# EAGLE design ATmega32_ComServ (EAGLE 6.1)
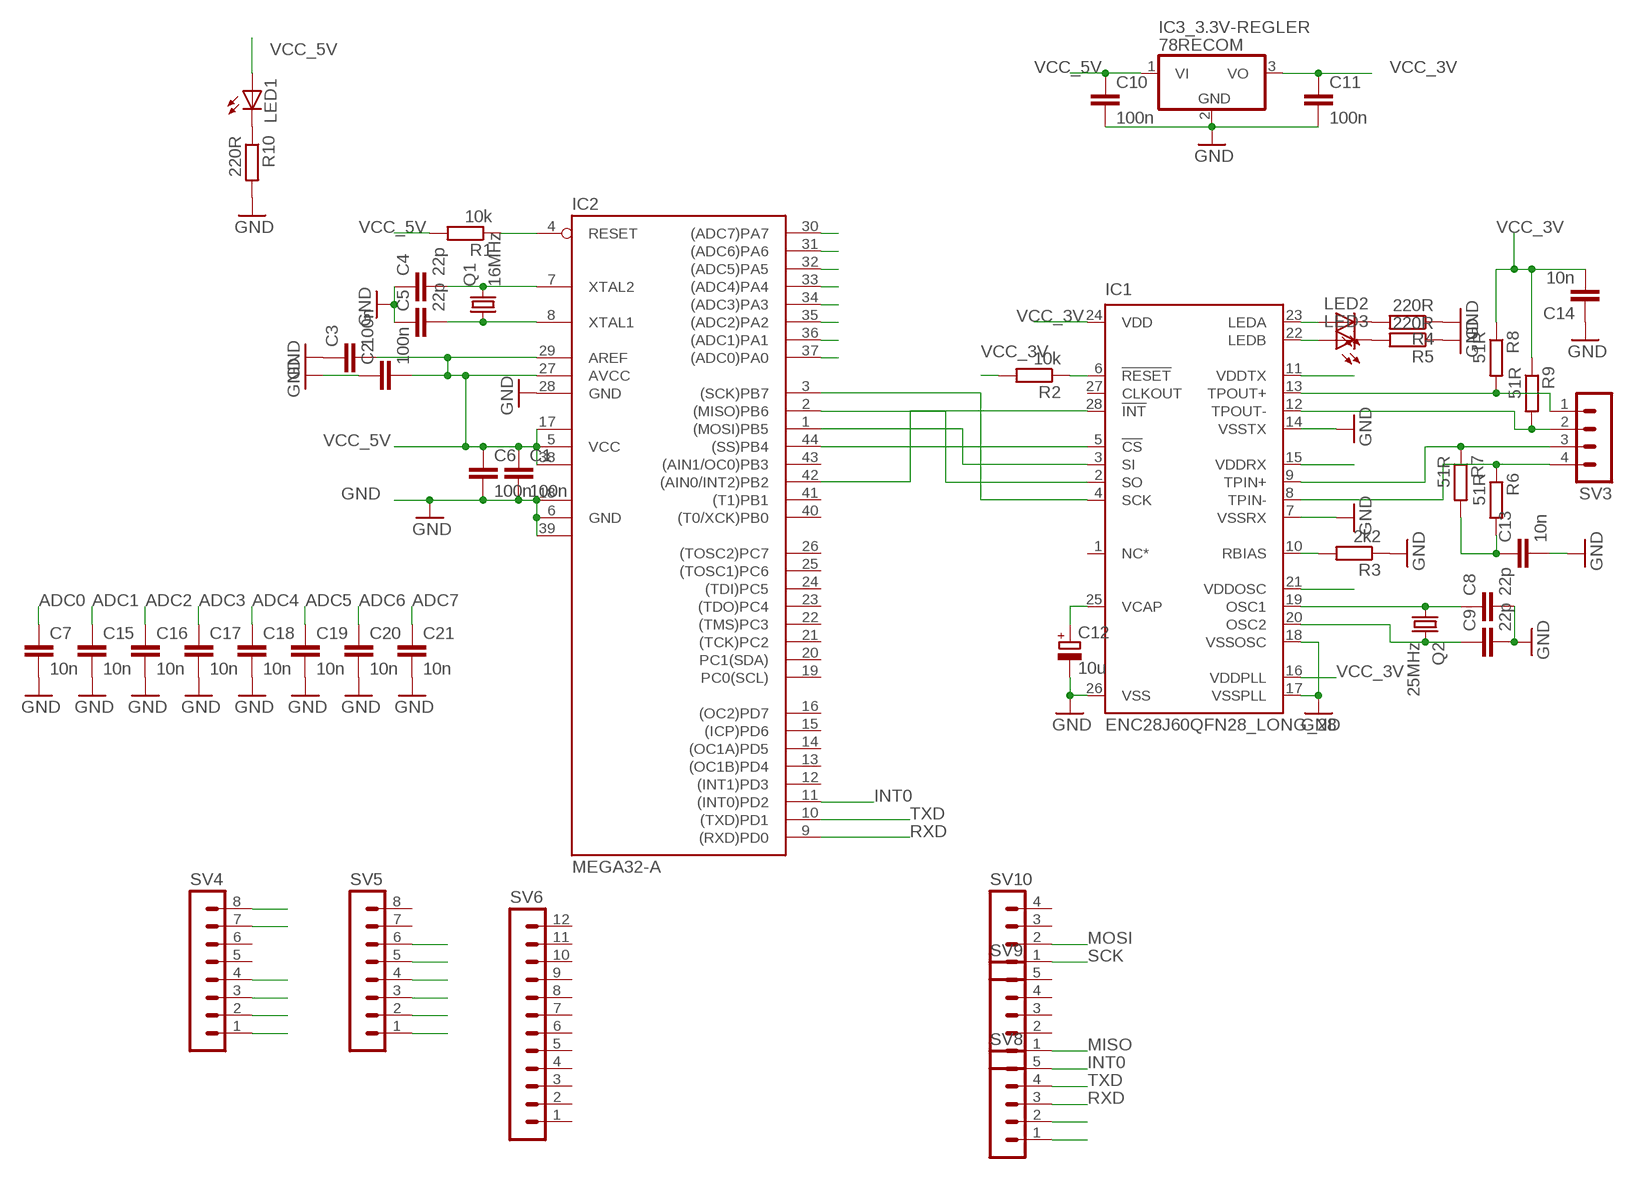
[diagram p0: schematic, sheet 1]

## Parts
C1  100n  C-EUC0805  [C0805]
C2  100n  C-EUC0805  [C0805]
C3  100n  C-EUC0805  [C0805]
C4  22p  C-EUC0805  [C0805]
C5  22p  C-EUC0805  [C0805]
C6  100n  C-EUC0805  [C0805]
C7  10n  C-EUC0805  [C0805]
C8  22p  C-EUC0805  [C0805]
C9  22p  C-EUC0805  [C0805]
C10  100n  C-EUC0805  [C0805]
C11  100n  C-EUC0805  [C0805]
C12  10u  CPOL-EUSMCD  [SMC_D]
C13  10n  C-EUC0805  [C0805]
C14  10n  C-EUC0805  [C0805]
C15  10n  C-EUC0805  [C0805]
C16  10n  C-EUC0805  [C0805]
C17  10n  C-EUC0805  [C0805]
C18  10n  C-EUC0805  [C0805]
C19  10n  C-EUC0805  [C0805]
C20  10n  C-EUC0805  [C0805]
C21  10n  C-EUC0805  [C0805]
IC1  ENC28J60QFN28_LONG_28  [QFN28_LONG_ERRLES]
IC2  MEGA32-A  [TQFP44]
IC3_3.3V-REGLER  78RECOM  [RECOM_3POL]
LED1  LEDCHIPLED_1206  [CHIPLED_1206]
LED2  LEDCHIPLED_1206  [CHIPLED_1206]
LED3  LEDCHIPLED_1206  [CHIPLED_1206]
Q1  16MHz  CRYSTALHC49S  [HC49/S]
Q2  25MHz  CRYSTALHC49S  [HC49/S]
R1  10k  R-EU_R1206  [R1206]
R2  10k  R-EU_R1206  [R1206]
R3  2k2  R-EU_R1206  [R1206]
R4  220R  R-EU_R1206  [R1206]
R5  220R  R-EU_R1206  [R1206]
R6  51R  R-EU_R0805  [R0805]
R7  51R  R-EU_R1206  [R1206]
R8  51R  R-EU_R0805  [R0805]
R9  51R  R-EU_R0805  [R0805]
R10  220R  R-EU_R1206  [R1206]
SV3  MA04-1  [MA04-1]
SV4  MA08-1  [MA08-1]
SV5  MA08-1  [MA08-1]
SV6  MA12-1  [MA12-1]
SV8  MA05-1  [MA05-1]
SV9  MA05-1  [MA05-1]
SV10  MA04-1  [MA04-1]

## Nets
1_TD+: IC1.13(TPOUT+) R8.2 SV3.1
2_TD-: IC1.12(TPOUT-) R9.2 SV3.2
3_RD+: IC1.9(TPIN+) R7.1 SV3.3
6_RD-: IC1.8(TPIN-) R6.1 SV3.4
ADC0: C7.1 IC2.37((ADC0)PA0) SV4.1
ADC1: C15.1 IC2.36((ADC1)PA1) SV4.2
ADC2: C16.1 IC2.35((ADC2)PA2) SV4.3
ADC3: C17.1 IC2.34((ADC3)PA3) SV4.4
ADC4: C18.1 IC2.33((ADC4)PA4) SV4.7
ADC5: C19.1 IC2.32((ADC5)PA5) SV4.8
ADC6: C20.1 IC2.31((ADC6)PA6) SV8.1
ADC7: C21.1 IC2.30((ADC7)PA7) SV8.2
GND: C1.2 C2.1 C3.1 C4.1 C5.1 C6.2 C7.2 C8.2 C9.2 C10.2 C11.2 C12.- C13.2 C14.1 C15.2 C16.2 C17.2 C18.2 C19.2 C20.2 C21.2 IC1.7(VSSRX) IC1.14(VSSTX) IC1.17(VSSPLL) IC1.18(VSSOSC) IC1.26(VSS) IC2.6(GND) IC2.18(GND1) IC2.28(GND) IC2.39(GND2) IC3_3.3V-REGLER.2(GND) R3.1 R4.1 R5.1 R10.2 SV5.2 SV5.3 SV5.6
INT0: IC2.11((INT0)PD2) SV8.5
MISO: IC1.2(SO) IC2.2((MISO)PB6) SV9.1
MOSI: IC1.3(SI) IC2.1((MOSI)PB5) SV10.2
N$1: C5.2 IC2.8(XTAL1) Q1.1
N$2: C4.2 IC2.7(XTAL2) Q1.2
N$3: LED1.C R10.1
N$4: C8.1 IC1.19(OSC1) Q2.1
N$5: C9.1 IC1.20(OSC2) Q2.2
N$6: C12.+ IC1.25(VCAP)
N$11: IC1.28(!INT) IC2.42((AIN0/INT2)PB2)
N$12: IC1.6(!RESET) R2.1
N$14: IC1.10(RBIAS) R3.2
N$19: LED2.C R4.2
N$20: IC1.23(LEDA) LED2.A
N$21: IC1.22(LEDB) LED3.A
N$22: LED3.C R5.2
N$23: C13.1 R6.2 R7.2
RESET: IC2.4(RESET) R1.1 SV5.1
RXD: IC2.9((RXD)PD0) SV8.3
SCK: IC1.4(SCK) IC2.3((SCK)PB7) SV10.1
SS: IC1.5(!CS) IC2.44((SS)PB4)
TXD: IC2.10((TXD)PD1) SV8.4
VCC_3V: C11.1 C14.2 IC1.11(VDDTX) IC1.15(VDDRX) IC1.16(VDDPLL) IC1.21(VDDOSC) IC1.24(VDD) IC3_3.3V-REGLER.3(VO) R2.2 R8.1 R9.1
VCC_5V: C1.1 C2.2 C3.2 C6.1 C10.1 IC2.5(VCC) IC2.17(VCC1) IC2.27(AVCC) IC2.29(AREF) IC2.38(VCC2) IC3_3.3V-REGLER.1(VI) LED1.A R1.2 SV5.4 SV5.5
Unconnected: IC1.1(NC*) IC1.27(CLKOUT) IC2.12((INT1)PD3) IC2.13((OC1B)PD4) IC2.14((OC1A)PD5) IC2.15((ICP)PD6) IC2.16((OC2)PD7) IC2.19(PC0(SCL)) IC2.20(PC1(SDA)) IC2.21((TCK)PC2) IC2.22((TMS)PC3) IC2.23((TDO)PC4) IC2.24((TDI)PC5) IC2.25((TOSC1)PC6) IC2.26((TOSC2)PC7) IC2.40((T0/XCK)PB0) IC2.41((T1)PB1) IC2.43((AIN1/OC0)PB3) SV4.5 SV4.6 SV5.7 SV5.8 SV6.1 SV6.2 SV6.3 SV6.4 SV6.5 SV6.6 SV6.7 SV6.8 SV6.9 SV6.10 SV6.11 SV6.12 SV9.2 SV9.3 SV9.4 SV9.5 SV10.3 SV10.4

## Library data of the parts
C1-C11 C13-C21 = rcl:C-EU: CAPACITOR, European symbol
C12 = rcl:CPOL-EU: POLARIZED CAPACITOR, European symbol
IC1 = microchip:ENC28J60: Stand-Alone Ethernet Controller with SPI Interface Source: http://ww1.microchip.com/downloads/en/DeviceDoc/39662c.pdf
IC2 = atmel:MEGA32: MICROCONTROLLER 32 Kbytes FLASH 2 Kbytes SRAM 1 Kbytes EEPROM USART 8-channel 10 bit ADC Source: www.atmel.com .. doc2503.pdf
IC3_3.3V-REGLER = linear:78*: Positive VOLTAGE REGULATOR Source: http://cache.national.com/ds/LM/LM78L05.pdf http://www.fairchildsemi.com/ds/LM/LM7805.pdf
LED1-LED3 = led:LED: LED OSRAM: - CHIPLED LG R971, LG N971, LY N971, LG Q971, LY Q971, LO R971, LY R971 LH N974, LH R974 LS Q976, LO Q976, LY Q976 LO Q996 - Hyper CHIPLED LW Q18S LB Q993, LB Q99A, LB R99A - SideLED LS A670, LO A670, LY A670, LG A670, LP A670 LB A673, LV A673, LT A673, LW A673 LH A674 LY A675 LS A676, LA A676, LO A676, LY A676, LW A676 LS A679, LY A679, LG A679 - Hyper Micro SIDELED® LS Y876, LA Y876, LO Y876, LY Y876 LT Y87S - SmartLED LW L88C, LW L88S LB L89C, LB L89S, LG L890 LS L89K, LO L89K, LY L89K LS L896, LA L896, LO L896, LY L896 - TOPLED LS T670, LO T670, LY T670, LG T670, LP T670 LSG T670, LSP T670, LSY T670, LOP T670, LYG T670 LG T671, LOG T671, LSG T671 LB T673, LV T673, LT T673, LW T673 LH T674 LS T676, LA T676, LO T676, LY T676, LB T676, LH T676, LSB T676, LW T676 LB T67C, LV T67C, LT T67C, LS T67K, LO T67K, LY T67K, LW E67C LS E67B, LA E67B, LO E67B, LY E67B, LB E67C, LV E67C, LT E67C LW T67C LS T679, LY T679, LG T679 LS T770, LO T770, LY T770, LG T770, LP T770 LB T773, LV T773, LT T773, LW T773 LH T774 LS E675, LA E675, LY E675, LS T675 LS T776, LA T776, LO T776, LY T776, LB T776 LHGB T686 LT T68C, LB T68C - Hyper Mini TOPLED® LB M676 - Mini TOPLED Santana® LG M470 LS M47K, LO M47K, LY M47K Source: http://www.osram.convergy.de LUXEON: - LUMILED® LXK2-PW12-R00, LXK2-PW12-S00, LXK2-PW14-U00, LXK2-PW14-V00 LXK2-PM12-R00, LXK2-PM12-S00, LXK2-PM14-U00 LXK2-PE12-Q00, LXK2-PE12-R00, LXK2-PE12-S00, LXK2-PE14-T00, LXK2-PE14-U00 LXK2-PB12-K00, LXK2-PB12-L00, LXK2-PB12-M00, LXK2-PB14-N00, LXK2-PB14-P00, LXK2-PB14-Q00 LXK2-PR12-L00, LXK2-PR12-M00, LXK2-PR14-Q00, LXK2-PR14-R00 LXK2-PD12-Q00, LXK2-PD12-R00, LXK2-PD12-S00 LXK2-PH12-R00, LXK2-PH12-S00 LXK2-PL12-P00, LXK2-PL12-Q00, LXK2-PL12-R00 Source: www.luxeon.com KINGBRIGHT: KA-3528ASYC Source: www.kingbright.com
Q1 Q2 = crystal:CRYSTAL: CRYSTAL
R1-R10 = rcl:R-EU_: RESISTOR, European symbol
SV3 SV10 = con-lstb:MA04-1: PIN HEADER
SV4 SV5 = con-lstb:MA08-1: PIN HEADER
SV6 = con-lstb:MA12-1: PIN HEADER
SV8 SV9 = con-lstb:MA05-1: PIN HEADER

## Board
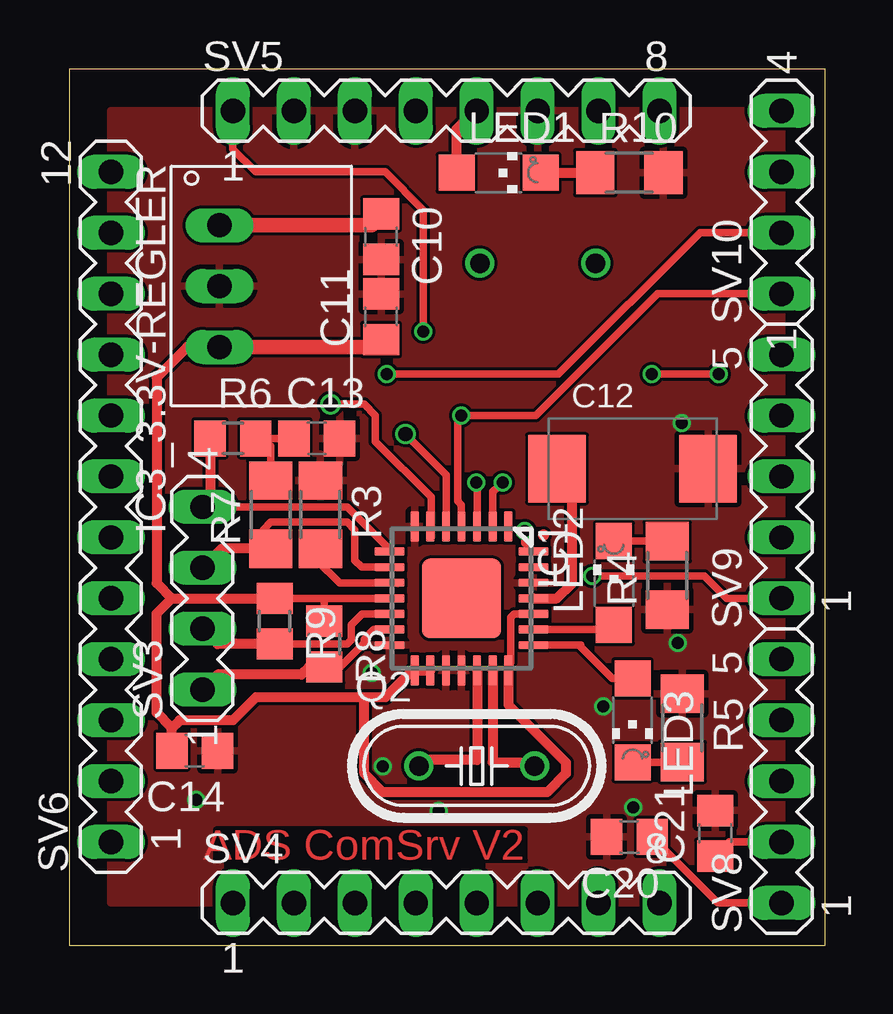
[diagram p1: board, top side]
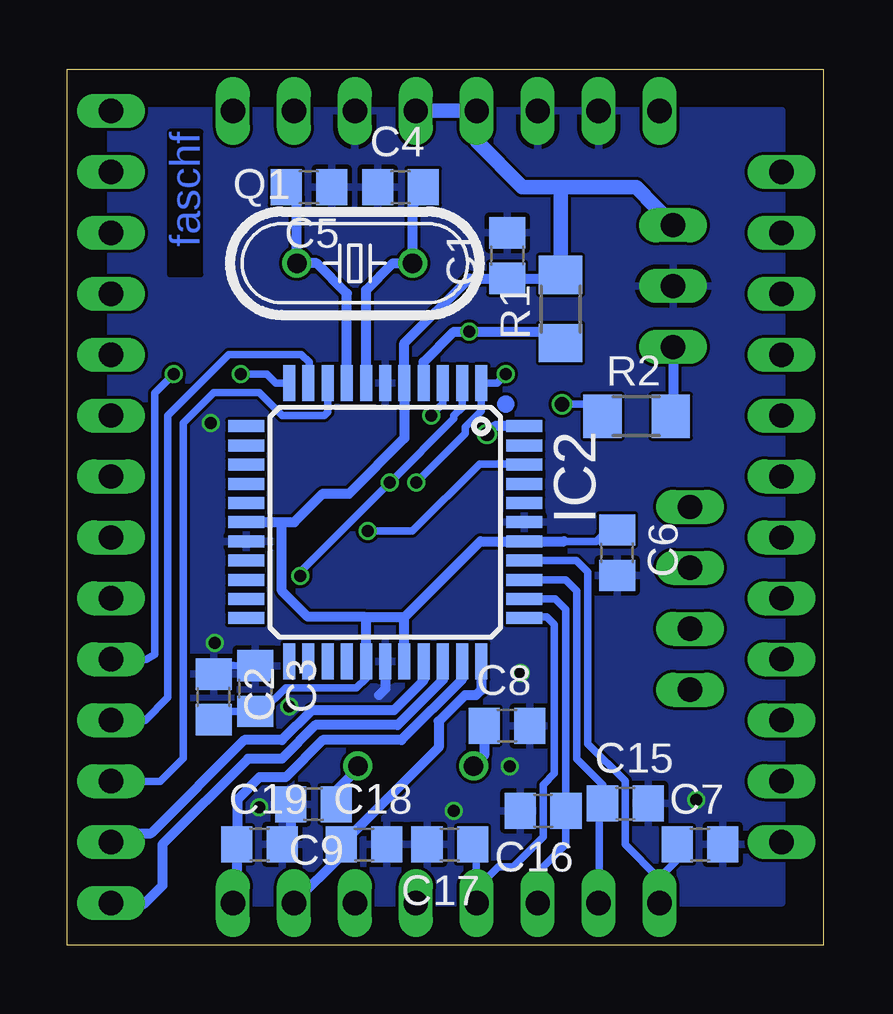
[diagram p2: board, bottom side, seen from below]

Size 31.5 x 36.53 mm. Coordinates in mm from the lower left corner, seen from the top.
Outline: 0,0 31.5,0 31.5,36.52 0,36.52 0,0
Copper layers (1*16): Top 0.035mm / dielectric 1.5mm / Bottom 0.035mm
Design rules: minimum track width 0.125mm, minimum drill 0.2mm, track to track 0.125mm, track to pad 0.125mm, pad to pad 0.125mm, via to via 0.125mm, smd to smd 0.125mm, copper to edge 0.3mm, drill to drill 0.2mm, minimum pad ring 0.2mm, minimum via ring 0.125mm, stop-mask expansion 0.075mm, vias tented up to drill 0mil, thermal gap 0.2mm

### Footprints (pad centres in the part's own frame; a part is rotated, then mirrored left to right if it is on the bottom)
C0805 = smd 1.3 x 1.5: 1 -0.95,0; 2 0.95,0
SMC_D = smd 2.4 x 2.8: + -3.15,0; - 3.15,0
QFN28_LONG_ERRLES = smd 1.27 x 0.35: 1 -3,1.95; 2 -3,1.3; 3 -3,0.65; 4 -3,0; 5 -3,-0.65; 6 -3,-1.3; 7 -3,-1.95; 15 3,-1.95; 16 3,-1.3; 17 3,-0.65; 18 3,0; 19 3,0.65; 20 3,1.3; 21 3,1.95 | smd 0.35 x 1.27: 8 -1.95,-3; 9 -1.3,-3; 10 -0.65,-3; 11 0,-3; 12 0.65,-3; 13 1.3,-3; 14 1.95,-3; 22 1.95,3; 23 1.3,3; 24 0.65,3; 25 0,3; 26 -0.65,3; 27 -1.3,3; 28 -1.95,3 | smd 3.302 x 3.302: EXP 0,0
TQFP44 = smd 1.5 x 0.5: 1 -5.8,4; 2 -5.8,3.2; 3 -5.8,2.4; 4 -5.8,1.6; 5 -5.8,0.8; 6 -5.8,0; 7 -5.8,-0.8; 8 -5.8,-1.6; 9 -5.8,-2.4; 10 -5.8,-3.2; 11 -5.8,-4; 23 5.8,-4; 24 5.8,-3.2; 25 5.8,-2.4; 26 5.8,-1.6; 27 5.8,-0.8; 28 5.8,0; 29 5.8,0.8; 30 5.8,1.6; 31 5.8,2.4; 32 5.8,3.2; 33 5.8,4 | smd 0.5 x 1.5: 12 -4,-5.8; 13 -3.2,-5.8; 14 -2.4,-5.8; 15 -1.6,-5.8; 16 -0.8,-5.8; 17 0,-5.8; 18 0.8,-5.8; 19 1.6,-5.8; 20 2.4,-5.8; 21 3.2,-5.8; 22 4,-5.8; 34 4,5.8; 35 3.2,5.8; 36 2.4,5.8; 37 1.6,5.8; 38 0.8,5.8; 39 0,5.8; 40 -0.8,5.8; 41 -1.6,5.8; 42 -2.4,5.8; 43 -3.2,5.8; 44 -4,5.8
RECOM_3POL = drill 1.016 long: 1 -2.54,0; 2 0,0; 3 2.54,0
CHIPLED_1206 = smd 1.5 x 1.5: A 0,-1.75; C 0,1.75
HC49/S = drill 0.813: 1 -2.413,0; 2 2.413,0
R1206 = smd 1.6 x 1.803: 1 -1.422,0; 2 1.422,0
R0805 = smd 1.3 x 1.5: 1 -0.95,0; 2 0.95,0
MA04-1 = drill 1.016 long: 1 -3.81,0; 2 -1.27,0; 3 1.27,0; 4 3.81,0
MA08-1 = drill 1.016 long: 1 -8.89,0; 2 -6.35,0; 3 -3.81,0; 4 -1.27,0; 5 1.27,0; 6 3.81,0; 7 6.35,0; 8 8.89,0
MA12-1 = drill 1.016 long: 1 -13.97,0; 2 -11.43,0; 3 -8.89,0; 4 -6.35,0; 5 -3.81,0; 6 -1.27,0; 7 1.27,0; 8 3.81,0; 9 6.35,0; 10 8.89,0; 11 11.43,0; 12 13.97,0
MA05-1 = drill 1.016 long: 1 -5.08,0; 2 -2.54,0; 3 0,0; 4 2.54,0; 5 5.08,0

### Placement (x,y rotation side)
C1  13.17,28.75 90 bottom
C2  25.4,10.35 270 bottom
C3  23.66,10.71 270 bottom
C4  17.61,31.61 0 bottom
C5  21.42,31.61 180 bottom
C6  8.59,16.37 270 bottom
C7  5.13,4.2 0 bottom
C8  13.18,9.15 0 bottom
C9  21.24,5.88 180 bottom
C10  12.99,29.54 270 top
C11  12.99,26.2 90 top
C12  23.47,19.87 0 top
C13  10.31,21.13 0 top
C14  5.23,8.11 180 top
C15  8.25,5.91 0 bottom
C16  11.67,5.6 180 bottom
C17  15.56,4.2 180 bottom
C18  19.14,4.2 0 bottom
C19  23.49,4.2 0 bottom
C20  23.34,4.51 180 top
C21  26.91,4.67 90 top
IC1  16.34,14.46 270 top
IC2  18.25,17.64 270 bottom
IC3_3.3V-REGLER  6.26,27.48 270 top
LED1  17.89,32.2 270 top
LED2  22.69,15.1 0 top
LED3  23.47,9.38 180 top
Q1  19.52,28.43 0 bottom
Q2  16.98,7.48 0 top
R1  10.94,26.53 90 bottom
R2  7.78,22.05 0 bottom
R3  10.46,17.95 270 top
R4  24.91,15.41 90 top
R5  25.54,9.06 270 top
R6  6.82,21.13 0 top
R7  8.4,17.95 90 top
R8  10.63,12.56 270 top
R9  8.55,13.51 270 top
R10  23.34,32.2 0 top
SV3  5.55,14.46 90 top
SV4  15.71,1.76 0 top
SV5  15.71,34.78 0 top
SV6  1.74,18.27 90 top
SV8  29.68,6.84 90 top
SV9  29.68,19.54 90 top
SV10  29.68,30.97 90 top

### Tracks (layer width: path | path; a pad name or v marks a point on that pad's centre or on a via)
1_TD+
  Top 0.305: IC1.13 12.7,13.16 12.29,12.76 12.29,12.6 11.29,11.61 R8.2 | R8.2 | R8.2 9.99,11.61
  Top 0.406: 9.99,11.61 9.67,11.29 6.18,11.29 SV3.1
2_TD-
  Top 0.305: IC1.12 12.2,13.81 11.74,13.35 11.74,12.72 11.58,12.56 8.09,12.56 R9.2
  Top 0.406: R9.2 6.18,12.56 SV3.2
3_RD+
  Top 0.305: IC1.9 12.18,15.76 11.9,16.05 11.9,17.32 11.58,17.64 8.4,17.64 8.09,17.32 R7.1
  Top 0.406: R7.1 6.35,16.53 SV3.3
6_RD-
  Top 0.305: IC1.8 13.44,16.41 11.58,18.27 SV3.4
  Top 0.406: R6.1 5.87,18.59 SV3.4
ADC0
  Bottom 0.305: IC2.37 10.28,16.04 9.8,15.56 9.8,8.4 8.24,6.84 8.24,4.2 6.84,2.8 | 6.84,2.8 6.84,1.79 SV4.1 | C7.1 6.08,3.56 6.84,2.8
ADC1
  Bottom 0.305: IC2.36 10.72,15.24 10.27,14.78 10.27,7.78 9.18,6.69 9.18,5.6 | 9.34,1.74 9.34,5.45 9.18,5.6 | 9.34,1.71 9.34,1.74 | 9.34,1.74 SV4.2 | 9.34,5.6 C15.1 9.18,5.6
ADC2
  Bottom 0.305: IC2.35 11.17,14.44 10.73,14 10.73,5.91 C16.1 10.73,5.6 | SV4.3 11.82,1.83 11.82,3.11 10.73,4.2 10.73,5.6 | 10.73,5.6 10.73,5.76
ADC3
  Bottom 0.305: 14.47,2.33 14.47,1.79 SV4.4 | IC2.34 12.45,13.69 11.51,13.69 11.2,13.38 11.2,7.16 11.67,6.69 11.67,4.51 12.91,3.27 13.54,3.27 14.47,2.33 | C17.1 14.45,4.03 14.47,2.33
ADC4
  Bottom 0.406: IC2.33 14.25,10.64 14.47,10.42 14.94,10.42 16.02,9.34 16.02,8.24 20.07,4.2 C18.1 | 20.23,4.2 C18.1 | C18.1 20.09,3.73 SV4.7
ADC5
  Bottom 0.406: SV4.8 24.44,1.92 C19.1 24.43,4.22 24.43,6.07 23.49,7 22.4,7 20.85,8.56 17.58,8.56 15.05,11.09 IC2.32
ADC6
  Top 0.305: SV8.1 27.02,1.76 24.27,4.51
  Top 0.406: 24.27,4.51 C20.1
  Bottom 0.406: IC2.31 15.85,11.07 17.74,9.18 21.16,9.18 22.56,7.78 23.96,7.78 27.54,4.2 27.54,2.49 28.32,1.71 29.63,1.71 SV8.1
ADC7
  Top 0.305: SV8.2 27.5,4.3 C21.1
  Bottom 0.406: IC2.30 16.65,11.05 17.89,9.8 21.31,9.8 22.56,8.56 24.11,8.56 28,4.67 29.31,4.67 SV8.2
GND  (via drill 0.5)
  Bottom 0.305: C3.1 24.1,11.66 24.58,11.67 25.3,11.67 C2.1
  Bottom 0.406: IC2.28 18.25,10.69 18.51,10.42 | C9.2 22.19,4.41 22.56,4.04 C19.2
  other vias: 5.29,6.07 25.51,21.78 12.6,11.36 25.36,12.6 13.07,7.47 22.25,9.96 15.4,5.6 23.49,5.76
  pour Bottom: 29.68,1.76 29.68,34.78 1.74,34.78 1.74,1.76
  pour Top: 1.74,1.76 29.68,1.76 29.68,34.78 1.74,34.78
INT0  (via drill 0.5 pad 0.25)
  Top 0.305: v24.27,23.8 v27.07,23.8
  Bottom 0.305: SV8.5 28.22,11.92 27.85,12.13 27.85,23.02 v27.07,23.8 | IC2.11 22.82,23.44 23.18,23.8 v24.27,23.8
MISO  (via drill 0.5 pad 0.25)
  Top 0.305: v18.05,19.29 17.64,18.92 IC1.2 17.64,18.89 18.05,19.29 | SV9.1 27.39,14.46 26.45,15.4 v21.78,15.4
  Bottom 0.305: IC2.2 15.05,22.43 15.39,22.08 15.39,21.95 18.05,19.29 v18.05,19.29 21.78,15.56 v21.78,15.4
MOSI  (via drill 0.5 pad 0.25)
  Top 0.305: IC1.3 16.99,19.1 v16.96,19.29 | v13.22,23.8 20.38,23.8 26.29,29.71 29.66,29.71 SV10.2
  Bottom 0.305: v16.96,19.29 14.91,21.34 14.91,21.61 14.25,22.27 IC2.1 13.59,23.44 v13.22,23.8
N$1
  Bottom 0.406: C5.2 21.93,31.16 Q1.1 21.1,28.43 19.85,27.18 IC2.8
N$2
  Bottom 0.305: C4.2 16.36,31.61 16.34,31.58
  Bottom 0.406: 16.98,31.61 C4.2 16.34,31.61 17.1,30.84 Q1.2 17.93,28.43 19.05,27.32 IC2.7
N$3
  Top 0.406: LED1.C R10.1
N$4
  Top 0.406: IC1.19 16.99,7.73 14.88,7.73 14.62,7.47 14.57,7.47 Q2.1
  Bottom 0.406: C8.1 14.13,7.91 Q2.1
N$5
  Top 0.406: IC1.20 17.64,7.63 19.23,7.63 Q2.2
  Bottom 0.305: 19.29,7.47 19.38,7.47 Q2.2
  Bottom 0.406: C9.1 20.45,6.31 19.29,7.47
N$6
  Top 0.305: 20.95,18.93 C12.+
  Top 0.406: IC1.25 20.32,14.46 20.95,15.09 20.95,18.93
N$11  (via drill 0.5 pad 0.25)
  Top 0.305: IC1.28 18.98,16.77 v18.98,17.27
  Bottom 0.305: v18.98,17.27 17.11,17.27 14.31,20.07 12.45,20.07 IC2.42
N$12  (via drill 0.6)
  Top 0.305: 15.07,17 15.07,17.13 | 15.07,17.13 IC1.6 | 15.07,17.13 15.07,18.69 12.76,21 12.76,22.09 12.29,22.56 v10.89,22.56
  Bottom 0.305: v10.89,22.56 9.8,22.56 9.2,21.95 | 9.18,22.09 9.18,21.94 9.2,21.95 | R2.1 9.2,21.95
N$14
  Top 0.305: 10.31,16.05 11.26,15.1 13.7,15.1 | 13.8,15.1 13.7,15.1 | 13.7,15.1 13.69,15.09 13.67,15.11 IC1.10
  Top 0.406: R3.2 10.31,16.05
N$19
  Top 0.305: LED2.C 24.75,16.85 24.91,16.68 R4.2
N$20
  Top 0.305: IC1.23 22.51,13.16 LED2.A
N$21
  Top 0.305: IC1.22 21.31,12.51 21.31,12.45 22.63,11.13 LED3.A
N$22
  Top 0.305: LED3.C 24.9,7.63 R5.2
N$23
  Top 0.305: R7.2 8.4,20.81 R6.2 C13.1
RESET  (via drill 0.5 pad 0.25)
  Top 0.305: SV5.1 6.82,33.2 7.77,32.24 13.17,32.24 14.75,30.66 v14.75,25.57
  Bottom 0.406: IC2.4 16.65,24.32 15.39,25.57 v14.75,25.57 11.26,25.57 10.94,25.26 R1.1 10.94,24.94
RXD
  Bottom 0.305: SV8.3 27.62,6.84 26.67,7.79 26.67,21.77 25.4,23.04 23.49,23.04 22.54,22.08 20.79,22.08 20.65,22.22 IC2.9
SCK  (via drill 0.5 pad 0.25)
  Top 0.305: SV10.1 24.52,27.16 19.44,22.08 v16.34,22.08 | IC1.4 16.34,18.35 16.18,18.51 16.18,21.92 v16.34,22.08 | v16.34,22.08 v16.34,22.09
  Bottom 0.305: IC2.3 15.85,22.58 v16.34,22.08
SS  (via drill 0.6)
  Top 0.305: IC1.5 15.71,17.18 15.71,19.6 v14,21.31
  Bottom 0.406: IC2.44 13.68,21.64 v14,21.31
TXD
  Bottom 0.305: SV8.4 28.26,9.38 27.3,10.34 27.3,22.09 24.77,24.62 21.74,24.62 21.42,24.3 21.42,23.46 IC2.10
VCC_3V
  Top 0.305: IC1.11 10.63,14.46 | R8.1 10.63,14.46 | 10.63,14.46 8.09,14.46 R9.1 | IC1.15 14.39,11.56 | 12.21,24.94 C11.1 13.48,24.94 | IC1.24 18.55,13.81 18.4,13.66 18.4,11.81 IC1.21
  Top 0.406: C14.2 4.28,9.06 | 4.28,9.06 3.64,9.7 3.64,13.83 4.28,14.46 | 4.28,14.46 8.09,14.46 | IC1.15 IC1.16 | 14.39,11.56 13.17,10.34 12.45,10.34 | 12.45,10.34 7.77,10.34 6.82,9.38 4.6,9.38 4.28,9.06 | IC3_3.3V-REGLER.3 4.91,24.94 3.64,23.67 3.64,15.1 4.28,14.46 | IC1.21 18.29,10.02 20.69,7.62 20.69,7.16 19.91,6.38 13.07,6.38 12.29,7.16 12.29,10.18 12.45,10.34
  Top 0.61: IC3_3.3V-REGLER.3 12.21,24.94
  Bottom 0.305: 6.22,24.89 6.22,24.91 IC3_3.3V-REGLER.3
  Bottom 0.406: R2.2 6.22,22.05 6.22,24.89
VCC_5V
  Top 0.406: LED1.A 16.14,34.03 16.96,34.85 16.96,34.8 SV5.5 | 12.6,30.02 13.07,30.49 C10.1
  Top 0.61: IC3_3.3V-REGLER.1 12.6,30.02
  Bottom 0.305: C2.2 24.82,9.76 C3.2 23.35,9.79 22.4,10.73 19.45,10.73 19.05,11.13 IC2.27 | C1.1 | 10.79,16.84 9.46,16.84 9.02,17.27 | 9.02,17.27 9.18,17.27 | 9.02,17.27 9.02,17.28 C6.1 | 22.56,17.58 22.46,17.58 22.4,17.64
  Bottom 0.406: 10.79,16.84 IC2.38 14.28,16.84 17.43,13.69 | C1.1 14.75,27.8 17.45,25.11 IC2.5 17.45,21.14 19.76,18.82 20.85,18.82 22.04,17.64 22.4,17.64 IC2.17 | C1.1 11.09,27.8 R1.2 | IC2.29 17.45,13.68 17.43,13.69 | 19.14,13.69 19.05,13.6 IC2.27 | 19.14,13.69 17.42,13.69 17.43,13.69 | 19.14,13.69 21.47,13.69 22.56,14.78 22.56,17.58
  Bottom 0.61: 10.94,31.61 12.53,31.61 14.44,33.51 SV5.4 SV5.5 | 10.94,31.61 7.79,31.61 IC3_3.3V-REGLER.1 | R1.2 10.94,31.61
(copper drawn outside any net)
  shapes: Bottom circle x1, Top circle x1

### Text on the board
Top: ADS ComSrv V2
Bottom: faschf